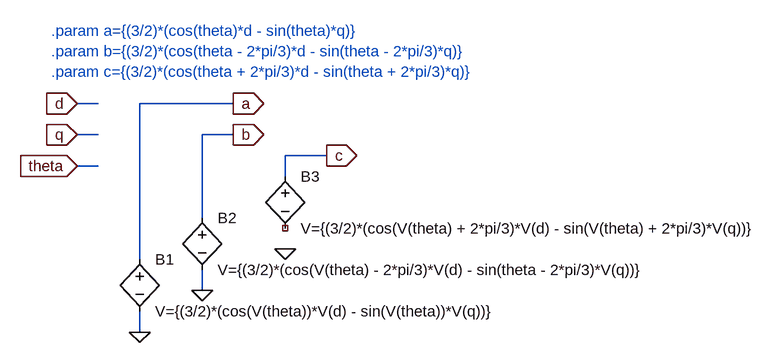
[diagram p0: schematic dqtoabc.asc]
dqtoabc.asc, the LTspice schematic file:
Version 4
SHEET 1 1480 680
WIRE 320 208 288 208
WIRE 528 208 384 208
WIRE 320 256 288 256
WIRE 528 256 480 256
WIRE 672 288 608 288
WIRE 320 304 288 304
WIRE 608 320 608 288
WIRE 480 384 480 256
WIRE 384 448 384 208
WIRE 480 496 480 464
WIRE 384 560 384 528
FLAG 288 208 d
IOPIN 288 208 In
FLAG 288 256 q
IOPIN 288 256 In
FLAG 528 208 a
IOPIN 528 208 Out
FLAG 528 256 b
IOPIN 528 256 Out
FLAG 672 288 c
IOPIN 672 288 Out
FLAG 288 304 theta
IOPIN 288 304 In
FLAG 384 560 0
FLAG 480 496 0
FLAG 608 432 0
SYMBOL bv 384 432 R0
SYMATTR InstName B1
SYMATTR Value V={(3/2)*(cos(V(theta))*V(d) - sin(V(theta))*V(q))}
SYMBOL bv 480 368 R0
SYMATTR InstName B2
SYMATTR Value V={(3/2)*(cos(V(theta) - 2*pi/3)*V(d) - sin(theta - 2*pi/3)*V(q))}
SYMBOL bv 608 304 R0
SYMATTR InstName B3
SYMATTR Value V={(3/2)*(cos(V(theta) + 2*pi/3)*V(d) - sin(V(theta) + 2*pi/3)*V(q))}
TEXT 248 96 Left 2 ;.param a={(3/2)*(cos(theta)*d - sin(theta)*q)}\n.param b={(3/2)*(cos(theta - 2*pi/3)*d - sin(theta - 2*pi/3)*q)}\n.param c={(3/2)*(cos(theta + 2*pi/3)*d - sin(theta + 2*pi/3)*q)}

The netlist it stands for:
* dqtoabc.asc
B1 a 0 V={(3/2)*(cos(V(theta))*V(d) - sin(V(theta))*V(q))}
B2 b 0 V={(3/2)*(cos(V(theta) - 2*pi/3)*V(d) - sin(theta - 2*pi/3)*V(q))}
B3 c NC_01 V={(3/2)*(cos(V(theta) + 2*pi/3)*V(d) - sin(V(theta) + 2*pi/3)*V(q))}
* .param a={(3/2)*(cos(theta)*d - sin(theta)*q)}
* .param b={(3/2)*(cos(theta - 2*pi/3)*d - sin(theta - 2*pi/3)*q)}
* .param c={(3/2)*(cos(theta + 2*pi/3)*d - sin(theta + 2*pi/3)*q)}
.backanno
.end